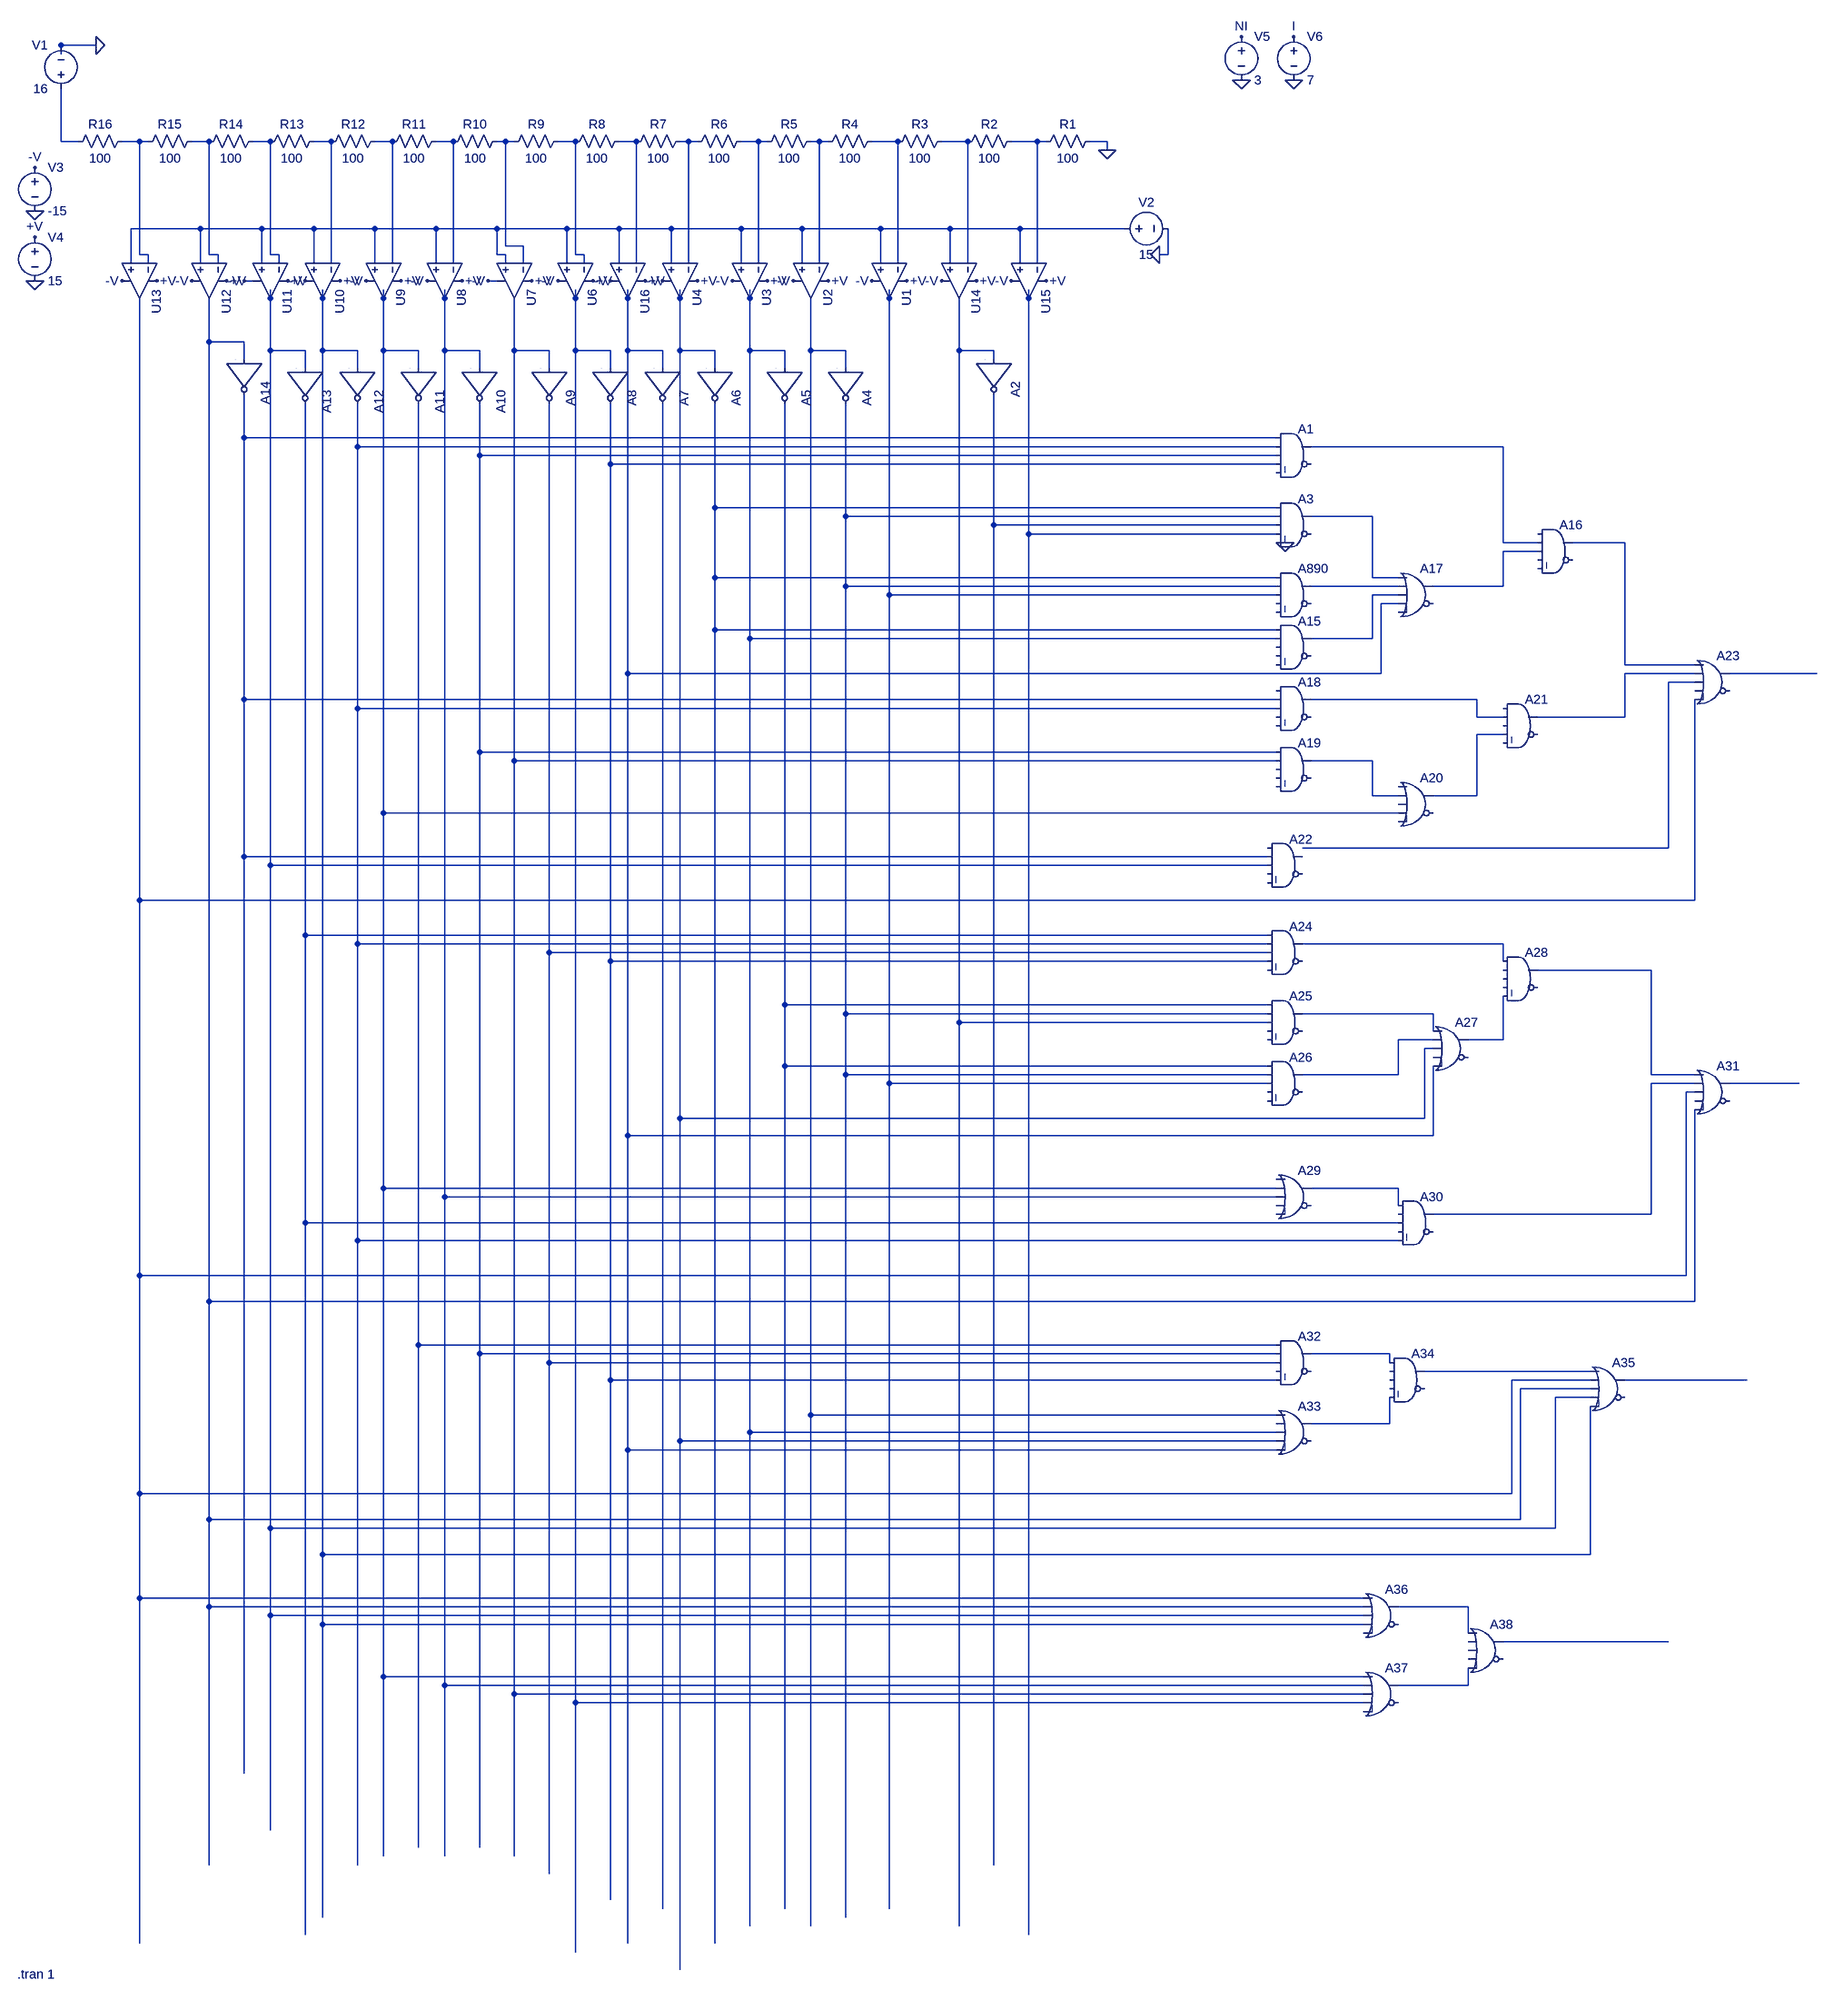
[diagram p0: schematic 4bit_flash_adc.asc]
4bit_flash_adc.asc, the LTspice schematic file:
Version 4
SHEET 1 2788 4056
WIRE -688 -896 -752 -896
WIRE -752 -880 -752 -896
WIRE -752 -720 -752 -816
WIRE -720 -720 -752 -720
WIRE -608 -720 -640 -720
WIRE -592 -720 -608 -720
WIRE -480 -720 -512 -720
WIRE -368 -720 -400 -720
WIRE -256 -720 -288 -720
WIRE -144 -720 -176 -720
WIRE -32 -720 -64 -720
WIRE 64 -720 48 -720
WIRE 80 -720 64 -720
WIRE 192 -720 160 -720
WIRE 304 -720 272 -720
WIRE 400 -720 384 -720
WIRE 416 -720 400 -720
WIRE 528 -720 496 -720
WIRE 544 -720 528 -720
WIRE 640 -720 624 -720
WIRE 656 -720 640 -720
WIRE 784 -720 736 -720
WIRE 912 -720 864 -720
WIRE 1040 -720 992 -720
WIRE 1056 -720 1040 -720
WIRE 1168 -720 1136 -720
WIRE 1168 -704 1168 -720
WIRE -496 -560 -624 -560
WIRE -384 -560 -496 -560
WIRE -288 -560 -384 -560
WIRE -176 -560 -288 -560
WIRE -64 -560 -176 -560
WIRE 48 -560 -64 -560
WIRE 176 -560 48 -560
WIRE 272 -560 176 -560
WIRE 368 -560 272 -560
WIRE 496 -560 368 -560
WIRE 608 -560 496 -560
WIRE 752 -560 608 -560
WIRE 880 -560 752 -560
WIRE 1008 -560 880 -560
WIRE 1200 -560 1008 -560
WIRE 64 -528 64 -720
WIRE 96 -528 64 -528
WIRE -608 -512 -608 -720
WIRE -592 -512 -608 -512
WIRE -480 -512 -480 -720
WIRE -464 -512 -480 -512
WIRE -368 -512 -368 -720
WIRE -352 -512 -368 -512
WIRE 48 -512 48 -560
WIRE 64 -512 48 -512
WIRE 192 -512 192 -720
WIRE 208 -512 192 -512
WIRE 1280 -512 1280 -560
WIRE 1280 -512 1264 -512
WIRE -624 -496 -624 -560
WIRE -592 -496 -592 -512
WIRE -496 -496 -496 -560
WIRE -464 -496 -464 -512
WIRE -384 -496 -384 -560
WIRE -352 -496 -352 -512
WIRE -288 -496 -288 -560
WIRE -256 -496 -256 -720
WIRE -176 -496 -176 -560
WIRE -144 -496 -144 -720
WIRE -64 -496 -64 -560
WIRE -32 -496 -32 -720
WIRE 64 -496 64 -512
WIRE 96 -496 96 -528
WIRE 176 -496 176 -560
WIRE 208 -496 208 -512
WIRE 272 -496 272 -560
WIRE 304 -496 304 -720
WIRE 368 -496 368 -560
WIRE 400 -496 400 -720
WIRE 496 -496 496 -560
WIRE 528 -496 528 -720
WIRE 608 -496 608 -560
WIRE 640 -496 640 -720
WIRE 752 -496 752 -560
WIRE 784 -496 784 -720
WIRE 880 -496 880 -560
WIRE 912 -496 912 -720
WIRE 1008 -496 1008 -560
WIRE 1040 -496 1040 -720
WIRE -400 -464 -416 -464
WIRE 48 -464 32 -464
WIRE -368 -432 -368 -448
WIRE -272 -432 -272 -448
WIRE -160 -432 -160 -448
WIRE -48 -432 -48 -448
WIRE 192 -432 192 -448
WIRE 288 -432 288 -448
WIRE 384 -432 384 -448
WIRE 512 -432 512 -448
WIRE 768 -432 768 -448
WIRE 1024 -432 1024 -448
WIRE -480 -352 -480 -432
WIRE -416 -352 -480 -352
WIRE -368 -336 -368 -432
WIRE -304 -336 -368 -336
WIRE -272 -336 -272 -432
WIRE -208 -336 -272 -336
WIRE -160 -336 -160 -432
WIRE -96 -336 -160 -336
WIRE -48 -336 -48 -432
WIRE 16 -336 -48 -336
WIRE 80 -336 80 -432
WIRE 144 -336 80 -336
WIRE 192 -336 192 -432
WIRE 256 -336 192 -336
WIRE 288 -336 288 -432
WIRE 352 -336 288 -336
WIRE 384 -336 384 -432
WIRE 448 -336 384 -336
WIRE 512 -336 512 -432
WIRE 576 -336 512 -336
WIRE 624 -336 624 -432
WIRE 688 -336 624 -336
WIRE 896 -336 896 -432
WIRE 960 -336 896 -336
WIRE -416 -320 -416 -352
WIRE 960 -320 960 -336
WIRE -304 -304 -304 -336
WIRE -208 -304 -208 -336
WIRE -96 -304 -96 -336
WIRE 16 -304 16 -336
WIRE 144 -304 144 -336
WIRE 256 -304 256 -336
WIRE 352 -304 352 -336
WIRE 448 -304 448 -336
WIRE 576 -304 576 -336
WIRE 688 -304 688 -336
WIRE -416 -176 -416 -256
WIRE 1520 -176 -416 -176
WIRE -208 -160 -208 -240
WIRE 1520 -160 -208 -160
WIRE 1936 -160 1584 -160
WIRE 16 -144 16 -240
WIRE 1520 -144 16 -144
WIRE 256 -128 256 -240
WIRE 1520 -128 256 -128
WIRE 448 -48 448 -240
WIRE 1520 -48 448 -48
WIRE 688 -32 688 -240
WIRE 1520 -32 688 -32
WIRE 1696 -32 1584 -32
WIRE 960 -16 960 -256
WIRE 1520 -16 960 -16
WIRE 1024 0 1024 -432
WIRE 1520 0 1024 0
WIRE 1936 16 1936 -160
WIRE 2000 16 1936 16
WIRE 2160 16 2064 16
WIRE 2000 32 1936 32
WIRE 448 80 448 -48
WIRE 1520 80 448 80
WIRE 1696 80 1696 -32
WIRE 1744 80 1696 80
WIRE 688 96 688 -32
WIRE 1520 96 688 96
WIRE 1744 96 1584 96
WIRE 1936 96 1936 32
WIRE 1936 96 1808 96
WIRE 768 112 768 -432
WIRE 1520 112 768 112
WIRE 1744 112 1696 112
WIRE 1744 128 1712 128
WIRE 448 176 448 80
WIRE 1520 176 448 176
WIRE 512 192 512 -336
WIRE 1520 192 512 192
WIRE 1696 192 1696 112
WIRE 1696 192 1584 192
WIRE 2160 240 2160 16
WIRE 2288 240 2160 240
WIRE 288 256 288 -336
WIRE 1712 256 1712 128
WIRE 1712 256 288 256
WIRE 2288 256 2160 256
WIRE 2512 256 2352 256
WIRE 2288 272 2240 272
WIRE -416 304 -416 -176
WIRE 1520 304 -416 304
WIRE 1888 304 1584 304
WIRE -208 320 -208 -160
WIRE 1520 320 -208 320
WIRE 1888 336 1888 304
WIRE 1936 336 1888 336
WIRE 2160 336 2160 256
WIRE 2160 336 2000 336
WIRE 1936 368 1888 368
WIRE 16 400 16 -144
WIRE 1520 400 16 400
WIRE 80 416 80 -336
WIRE 1520 416 80 416
WIRE 1696 416 1584 416
WIRE 1696 480 1696 416
WIRE 1744 480 1696 480
WIRE 1888 480 1888 368
WIRE 1888 480 1808 480
WIRE -160 512 -160 -336
WIRE 1744 512 -160 512
WIRE 2240 576 2240 272
WIRE 2240 576 1568 576
WIRE -416 592 -416 304
WIRE 1504 592 -416 592
WIRE -368 608 -368 -336
WIRE 1504 608 -368 608
WIRE -608 672 -608 -432
WIRE 2288 672 2288 304
WIRE 2288 672 -608 672
WIRE -304 736 -304 -240
WIRE 1504 736 -304 736
WIRE -208 752 -208 320
WIRE 1504 752 -208 752
WIRE 1936 752 1568 752
WIRE 144 768 144 -240
WIRE 1504 768 144 768
WIRE 256 784 256 -128
WIRE 1504 784 256 784
WIRE 1936 784 1936 752
WIRE 2208 800 2000 800
WIRE 576 864 576 -240
WIRE 1504 864 576 864
WIRE 688 880 688 96
WIRE 1504 880 688 880
WIRE 1808 880 1568 880
WIRE 896 896 896 -336
WIRE 1504 896 896 896
WIRE 1808 912 1808 880
WIRE 1808 928 1744 928
WIRE 1936 928 1936 848
WIRE 1936 928 1872 928
WIRE 1808 944 1792 944
WIRE 576 976 576 864
WIRE 1504 976 576 976
WIRE 688 992 688 880
WIRE 1504 992 688 992
WIRE 1744 992 1744 928
WIRE 1744 992 1568 992
WIRE 2208 992 2208 800
WIRE 2288 992 2208 992
WIRE 768 1008 768 112
WIRE 1504 1008 768 1008
WIRE 2288 1008 2208 1008
WIRE 2480 1008 2352 1008
WIRE 2288 1024 2272 1024
WIRE 384 1072 384 -336
WIRE 1792 1072 1792 944
WIRE 1792 1072 384 1072
WIRE 288 1104 288 256
WIRE 1808 1104 1808 976
WIRE 1808 1104 288 1104
WIRE -160 1200 -160 512
WIRE 1520 1200 -160 1200
WIRE 1744 1200 1584 1200
WIRE -48 1216 -48 -336
WIRE 1520 1216 -48 1216
WIRE 1744 1232 1744 1200
WIRE 2208 1248 2208 1008
WIRE 2208 1248 1808 1248
WIRE -304 1264 -304 736
WIRE 1744 1264 -304 1264
WIRE -208 1296 -208 752
WIRE 1744 1296 -208 1296
WIRE -608 1360 -608 672
WIRE 2272 1360 2272 1024
WIRE 2272 1360 -608 1360
WIRE -480 1408 -480 -352
WIRE 2288 1408 2288 1056
WIRE 2288 1408 -480 1408
WIRE -96 1488 -96 -240
WIRE 1520 1488 -96 1488
WIRE 16 1504 16 400
WIRE 1520 1504 16 1504
WIRE 1728 1504 1584 1504
WIRE 144 1520 144 768
WIRE 1520 1520 144 1520
WIRE 1728 1520 1728 1504
WIRE 2096 1536 1792 1536
WIRE 256 1552 256 784
WIRE 1520 1552 256 1552
WIRE 2096 1552 1952 1552
WIRE 2384 1552 2160 1552
WIRE 2096 1568 1968 1568
WIRE 2096 1584 2032 1584
WIRE 624 1616 624 -336
WIRE 1520 1616 624 1616
WIRE 1728 1632 1728 1584
WIRE 1728 1632 1584 1632
WIRE 512 1648 512 192
WIRE 1520 1648 512 1648
WIRE 384 1664 384 1072
WIRE 1520 1664 384 1664
WIRE 288 1680 288 1104
WIRE 1520 1680 288 1680
WIRE -608 1760 -608 1360
WIRE 1952 1760 1952 1552
WIRE 1952 1760 -608 1760
WIRE -480 1808 -480 1408
WIRE 1968 1808 1968 1568
WIRE 1968 1808 -480 1808
WIRE -368 1824 -368 608
WIRE 2032 1824 2032 1584
WIRE 2032 1824 -368 1824
WIRE -272 1872 -272 -336
WIRE 2096 1872 2096 1600
WIRE 2096 1872 -272 1872
WIRE -608 1952 -608 1760
WIRE 1680 1952 -608 1952
WIRE -480 1968 -480 1808
WIRE 1680 1968 -480 1968
WIRE 1872 1968 1744 1968
WIRE -368 1984 -368 1824
WIRE 1680 1984 -368 1984
WIRE -272 2000 -272 1872
WIRE 1680 2000 -272 2000
WIRE 1872 2016 1872 1968
WIRE 2240 2032 1936 2032
WIRE -160 2096 -160 1200
WIRE 1680 2096 -160 2096
WIRE -48 2112 -48 1216
WIRE 1680 2112 -48 2112
WIRE 1872 2112 1872 2080
WIRE 1872 2112 1744 2112
WIRE 80 2128 80 416
WIRE 1680 2128 80 2128
WIRE 192 2144 192 -336
WIRE 1680 2144 192 2144
WIRE -416 3584 -416 592
WIRE -368 3776 -368 1984
WIRE -96 3808 -96 1488
WIRE 16 3808 16 1504
WIRE -160 3824 -160 2096
WIRE -48 3824 -48 2112
WIRE 80 3824 80 2128
WIRE -480 3840 -480 1968
WIRE -208 3840 -208 1296
WIRE 960 3840 960 -16
WIRE 144 3856 144 1520
WIRE 256 3904 256 1552
WIRE 352 3920 352 -240
WIRE 576 3920 576 976
WIRE 768 3920 768 1008
WIRE -272 3936 -272 2000
WIRE 688 3936 688 992
WIRE 512 3952 512 1648
WIRE 624 3952 624 1616
WIRE 896 3952 896 896
WIRE -304 3968 -304 1264
WIRE 1024 3968 1024 0
WIRE -608 3984 -608 1952
WIRE 288 3984 288 1680
WIRE 448 3984 448 176
WIRE 192 4000 192 2144
WIRE 384 4032 384 1664
FLAG 1264 -512 0
FLAG -800 -592 0
FLAG -800 -464 0
FLAG -800 -672 -V
FLAG -640 -464 -V
FLAG -512 -464 -V
FLAG -304 -464 -V
FLAG -416 -464 -V
FLAG -192 -464 -V
FLAG -80 -464 -V
FLAG 32 -464 -V
FLAG 160 -464 -V
FLAG 480 -464 -V
FLAG 592 -464 -V
FLAG 736 -464 -V
FLAG 864 -464 -V
FLAG 992 -464 -V
FLAG -800 -544 +V
FLAG -576 -464 +V
FLAG -448 -464 +V
FLAG -336 -464 +V
FLAG -240 -464 +V
FLAG -128 -464 +V
FLAG -16 -464 +V
FLAG 112 -464 +V
FLAG 416 -464 +V
FLAG 544 -464 +V
FLAG 656 -464 +V
FLAG 800 -464 +V
FLAG 928 -464 +V
FLAG 1056 -464 +V
FLAG -688 -896 0
FLAG 1168 -704 0
FLAG 352 -464 -V
FLAG 320 -464 +V
FLAG 256 -464 -V
FLAG 224 -464 +V
FLAG 1456 -832 0
FLAG 1552 -832 0
FLAG 1456 -912 NI
FLAG 1552 -912 I
FLAG 1536 16 0
SYMBOL res 1152 -736 R90
WINDOW 0 0 56 VBottom 2
WINDOW 3 32 56 VTop 2
SYMATTR InstName R1
SYMATTR Value 100
SYMBOL res 1008 -736 R90
WINDOW 0 0 56 VBottom 2
WINDOW 3 32 56 VTop 2
SYMATTR InstName R2
SYMATTR Value 100
SYMBOL res 880 -736 R90
WINDOW 0 0 56 VBottom 2
WINDOW 3 32 56 VTop 2
SYMATTR InstName R3
SYMATTR Value 100
SYMBOL res 752 -736 R90
WINDOW 0 0 56 VBottom 2
WINDOW 3 32 56 VTop 2
SYMATTR InstName R4
SYMATTR Value 100
SYMBOL res 640 -736 R90
WINDOW 0 0 56 VBottom 2
WINDOW 3 32 56 VTop 2
SYMATTR InstName R5
SYMATTR Value 100
SYMBOL res 512 -736 R90
WINDOW 0 0 56 VBottom 2
WINDOW 3 32 56 VTop 2
SYMATTR InstName R6
SYMATTR Value 100
SYMBOL res 400 -736 R90
WINDOW 0 0 56 VBottom 2
WINDOW 3 32 56 VTop 2
SYMATTR InstName R7
SYMATTR Value 100
SYMBOL res 288 -736 R90
WINDOW 0 0 56 VBottom 2
WINDOW 3 32 56 VTop 2
SYMATTR InstName R8
SYMATTR Value 100
SYMBOL res 176 -736 R90
WINDOW 0 0 56 VBottom 2
WINDOW 3 32 56 VTop 2
SYMATTR InstName R9
SYMATTR Value 100
SYMBOL res 64 -736 R90
WINDOW 0 0 56 VBottom 2
WINDOW 3 32 56 VTop 2
SYMATTR InstName R10
SYMATTR Value 100
SYMBOL res -48 -736 R90
WINDOW 0 0 56 VBottom 2
WINDOW 3 32 56 VTop 2
SYMATTR InstName R11
SYMATTR Value 100
SYMBOL res -160 -736 R90
WINDOW 0 0 56 VBottom 2
WINDOW 3 32 56 VTop 2
SYMATTR InstName R12
SYMATTR Value 100
SYMBOL res -272 -736 R90
WINDOW 0 0 56 VBottom 2
WINDOW 3 32 56 VTop 2
SYMATTR InstName R13
SYMATTR Value 100
SYMBOL res -384 -736 R90
WINDOW 0 0 56 VBottom 2
WINDOW 3 32 56 VTop 2
SYMATTR InstName R14
SYMATTR Value 100
SYMBOL res -496 -736 R90
WINDOW 0 0 56 VBottom 2
WINDOW 3 32 56 VTop 2
SYMATTR InstName R15
SYMATTR Value 100
SYMBOL res -624 -736 R90
WINDOW 0 0 56 VBottom 2
WINDOW 3 32 56 VTop 2
SYMATTR InstName R16
SYMATTR Value 100
SYMBOL voltage 1184 -560 R270
WINDOW 0 32 56 VTop 2
WINDOW 3 -32 56 VBottom 2
WINDOW 123 0 0 Left 0
WINDOW 39 0 0 Left 0
SYMATTR InstName V2
SYMATTR Value 15
SYMBOL Digital\\inv -352 -320 R90
SYMATTR InstName A14
SYMBOL Digital\\inv -240 -304 R90
SYMATTR InstName A13
SYMBOL Digital\\inv -144 -304 R90
SYMATTR InstName A12
SYMBOL Digital\\inv -32 -304 R90
SYMATTR InstName A11
SYMBOL Digital\\inv 80 -304 R90
SYMATTR InstName A10
SYMBOL Digital\\inv 1024 -320 R90
SYMATTR InstName A2
SYMBOL Digital\\inv 752 -304 R90
SYMATTR InstName A4
SYMBOL Digital\\inv 640 -304 R90
SYMATTR InstName A5
SYMBOL Digital\\inv 512 -304 R90
SYMATTR InstName A6
SYMBOL Digital\\inv 416 -304 R90
SYMATTR InstName A7
SYMBOL Digital\\inv 208 -304 R90
SYMATTR InstName A9
SYMBOL Digital\\and 1552 -208 R0
SYMATTR InstName A1
SYMBOL Digital\\and 1552 -80 R0
SYMATTR InstName A3
SYMBOL Digital\\and 1552 48 R0
SYMATTR InstName A890
SYMBOL Digital\\and 1552 144 R0
SYMATTR InstName A15
SYMBOL Digital\\or 1776 48 R0
SYMATTR InstName A17
SYMBOL Digital\\and 2032 -32 R0
SYMATTR InstName A16
SYMBOL Digital\\and 1552 256 R0
SYMATTR InstName A18
SYMBOL Digital\\and 1552 368 R0
SYMATTR InstName A19
SYMBOL Digital\\or 1776 432 R0
SYMATTR InstName A20
SYMBOL Digital\\and 1968 288 R0
SYMATTR InstName A21
SYMBOL Digital\\and 1536 544 R0
SYMATTR InstName A22
SYMBOL Digital\\or 2320 208 R0
SYMATTR InstName A23
SYMBOL Digital\\and 1536 704 R0
SYMATTR InstName A24
SYMBOL Digital\\inv 320 -304 R90
SYMATTR InstName A8
SYMBOL Digital\\and 1536 832 R0
SYMATTR InstName A25
SYMBOL Digital\\and 1536 944 R0
SYMATTR InstName A26
SYMBOL Digital\\or 1840 880 R0
SYMATTR InstName A27
SYMBOL Digital\\and 1968 752 R0
SYMATTR InstName A28
SYMBOL Digital\\or 1552 1152 R0
SYMATTR InstName A29
SYMBOL Digital\\and 1776 1200 R0
SYMATTR InstName A30
SYMBOL Digital\\or 2320 960 R0
SYMATTR InstName A31
SYMBOL Digital\\and 1552 1456 R0
SYMATTR InstName A32
SYMBOL Digital\\or 1552 1584 R0
SYMATTR InstName A33
SYMBOL Digital\\and 1760 1488 R0
SYMATTR InstName A34
SYMBOL Digital\\or 2128 1504 R0
SYMATTR InstName A35
SYMBOL Digital\\or 1712 1920 R0
SYMATTR InstName A36
SYMBOL Digital\\or 1712 2064 R0
SYMATTR InstName A37
SYMBOL Digital\\or 1904 1984 R0
SYMATTR InstName A38
SYMBOL voltage -800 -688 R0
WINDOW 123 0 0 Left 0
WINDOW 39 0 0 Left 0
SYMATTR InstName V3
SYMATTR Value -15
SYMBOL voltage -800 -560 R0
WINDOW 123 0 0 Left 0
WINDOW 39 0 0 Left 0
SYMATTR InstName V4
SYMATTR Value 15
SYMBOL voltage -752 -800 R180
WINDOW 0 24 96 Left 2
WINDOW 3 24 16 Left 2
WINDOW 123 0 0 Left 0
WINDOW 39 0 0 Left 0
SYMATTR InstName V1
SYMATTR Value 16
SYMBOL OpAmps\\UniversalOpAmp2 1024 -464 R90
SYMATTR InstName U15
SYMBOL OpAmps\\UniversalOpAmp2 768 -464 R90
SYMATTR InstName U1
SYMBOL OpAmps\\UniversalOpAmp2 624 -464 R90
SYMATTR InstName U2
SYMBOL OpAmps\\UniversalOpAmp2 512 -464 R90
SYMATTR InstName U3
SYMBOL OpAmps\\UniversalOpAmp2 384 -464 R90
SYMATTR InstName U4
SYMBOL OpAmps\\UniversalOpAmp2 192 -464 R90
SYMATTR InstName U6
SYMBOL OpAmps\\UniversalOpAmp2 80 -464 R90
SYMATTR InstName U7
SYMBOL OpAmps\\UniversalOpAmp2 -48 -464 R90
SYMATTR InstName U8
SYMBOL OpAmps\\UniversalOpAmp2 -160 -464 R90
SYMATTR InstName U9
SYMBOL OpAmps\\UniversalOpAmp2 -272 -464 R90
SYMATTR InstName U10
SYMBOL OpAmps\\UniversalOpAmp2 -368 -464 R90
SYMATTR InstName U11
SYMBOL OpAmps\\UniversalOpAmp2 -480 -464 R90
SYMATTR InstName U12
SYMBOL OpAmps\\UniversalOpAmp2 -608 -464 R90
SYMATTR InstName U13
SYMBOL OpAmps\\UniversalOpAmp2 896 -464 R90
SYMATTR InstName U14
SYMBOL OpAmps\\UniversalOpAmp2 288 -464 R90
SYMATTR InstName U16
SYMBOL voltage 1456 -928 R0
WINDOW 123 0 0 Left 0
WINDOW 39 0 0 Left 0
SYMATTR InstName V5
SYMATTR Value 3
SYMBOL voltage 1552 -928 R0
WINDOW 123 0 0 Left 0
WINDOW 39 0 0 Left 0
SYMATTR InstName V6
SYMATTR Value 7
TEXT -832 4040 Left 2 !.tran 1

The netlist it stands for:
* 4bit_flash_adc.asc
R1 0 N016 100
R2 N016 N015 100
R3 N015 N014 100
R4 N014 N013 100
R5 N013 N012 100
R6 N012 N011 100
R7 N011 N010 100
R8 N010 N009 100
R9 N009 N008 100
R10 N008 N007 100
R11 N007 N006 100
R12 N006 N005 100
R13 N005 N004 100
R14 N004 N003 100
R15 N003 N002 100
R16 N002 N001 100
V2 N017 0 15
A14 N028 0 0 0 0 N032 0 0 BUF
A13 N018 0 0 0 0 N052 0 0 BUF
A12 N019 0 0 0 0 N033 0 0 BUF
A11 N020 0 0 0 0 N063 0 0 BUF
A10 N021 0 0 0 0 N035 0 0 BUF
A2 N031 0 0 0 0 N040 0 0 BUF
A4 N030 0 0 0 0 N038 0 0 BUF
A5 N025 0 0 0 0 N056 0 0 BUF
A6 N024 0 0 0 0 N037 0 0 BUF
A7 N023 0 0 0 0 N071 0 0 BUF
A9 N029 0 0 0 0 N054 0 0 BUF
A1 N032 N033 N035 N036 0 0 N034 0 AND
A3 N037 N038 N040 N027 0 0 N039 0 AND
A890 N037 N038 N026 0 0 0 N043 0 AND
A15 N037 N025 0 0 0 0 N044 0 AND
A17 N039 N043 N044 N023 0 0 N042 0 OR
A16 0 N034 N042 0 0 0 N041 0 AND
A18 0 N032 N033 0 0 0 N048 0 AND
A19 N035 N029 0 0 0 0 N050 0 AND
A20 0 N050 0 N020 0 0 N049 0 OR
A21 0 N048 0 N049 0 0 N045 0 AND
A22 0 N032 N018 0 0 0 0 0 AND
A23 N041 N045 N047 0 N051 0 N046 0 OR
A24 N052 N033 N054 N036 0 0 N053 0 AND
A8 N022 0 0 0 0 N036 0 0 BUF
A25 N056 N038 N031 0 0 0 N057 0 AND
A26 N056 N038 N026 0 0 0 N058 0 AND
A27 N057 N058 N024 0 N023 0 N059 0 OR
A28 N053 0 0 0 N059 0 N055 0 AND
A29 0 N020 N021 0 0 0 N062 0 OR
A30 N062 0 N052 0 N033 0 N060 0 AND
A31 N055 N060 N051 0 N028 0 N061 0 OR
A32 N063 N035 N054 0 N036 0 N064 0 AND
A33 N030 0 N025 N024 N023 0 N067 0 OR
A34 N064 0 0 0 N067 0 N065 0 AND
A35 N065 N051 N028 N018 N019 0 N066 0 OR
A36 N051 N028 N018 N019 0 0 N068 0 OR
A37 N020 N021 N029 N022 0 0 N070 0 OR
A38 N068 0 0 0 N070 0 N069 0 OR
V3 -V 0 -15
V4 +V 0 15
V1 N001 0 16
XU15 N017 N016 +V -V N027 level2 Avol=1Meg GBW=10Meg Slew=10Meg Ilimit=25m Rail=0 Vos=0 En=0 Enk=0 In=0 Ink=0 Rin=500Meg  ; pins In+ In- V+ V- OUT
XU1 N017 N014 +V -V N026 level2 Avol=1Meg GBW=10Meg Slew=10Meg Ilimit=25m Rail=0 Vos=0 En=0 Enk=0 In=0 Ink=0 Rin=500Meg  ; pins In+ In- V+ V- OUT
XU2 N017 N013 +V -V N030 level2 Avol=1Meg GBW=10Meg Slew=10Meg Ilimit=25m Rail=0 Vos=0 En=0 Enk=0 In=0 Ink=0 Rin=500Meg  ; pins In+ In- V+ V- OUT
XU3 N017 N012 +V -V N025 level2 Avol=1Meg GBW=10Meg Slew=10Meg Ilimit=25m Rail=0 Vos=0 En=0 Enk=0 In=0 Ink=0 Rin=500Meg  ; pins In+ In- V+ V- OUT
XU4 N017 N011 +V -V N024 level2 Avol=1Meg GBW=10Meg Slew=10Meg Ilimit=25m Rail=0 Vos=0 En=0 Enk=0 In=0 Ink=0 Rin=500Meg  ; pins In+ In- V+ V- OUT
XU6 N017 N009 +V -V N022 level2 Avol=1Meg GBW=10Meg Slew=10Meg Ilimit=25m Rail=0 Vos=0 En=0 Enk=0 In=0 Ink=0 Rin=500Meg  ; pins In+ In- V+ V- OUT
XU7 N017 N008 +V -V N029 level2 Avol=1Meg GBW=10Meg Slew=10Meg Ilimit=25m Rail=0 Vos=0 En=0 Enk=0 In=0 Ink=0 Rin=500Meg  ; pins In+ In- V+ V- OUT
XU8 N017 N007 +V -V N021 level2 Avol=1Meg GBW=10Meg Slew=10Meg Ilimit=25m Rail=0 Vos=0 En=0 Enk=0 In=0 Ink=0 Rin=500Meg  ; pins In+ In- V+ V- OUT
XU9 N017 N006 +V -V N020 level2 Avol=1Meg GBW=10Meg Slew=10Meg Ilimit=25m Rail=0 Vos=0 En=0 Enk=0 In=0 Ink=0 Rin=500Meg  ; pins In+ In- V+ V- OUT
XU10 N017 N005 +V -V N019 level2 Avol=1Meg GBW=10Meg Slew=10Meg Ilimit=25m Rail=0 Vos=0 En=0 Enk=0 In=0 Ink=0 Rin=500Meg  ; pins In+ In- V+ V- OUT
XU11 N017 N004 +V -V N018 level2 Avol=1Meg GBW=10Meg Slew=10Meg Ilimit=25m Rail=0 Vos=0 En=0 Enk=0 In=0 Ink=0 Rin=500Meg  ; pins In+ In- V+ V- OUT
XU12 N017 N003 +V -V N028 level2 Avol=1Meg GBW=10Meg Slew=10Meg Ilimit=25m Rail=0 Vos=0 En=0 Enk=0 In=0 Ink=0 Rin=500Meg  ; pins In+ In- V+ V- OUT
XU13 N017 N002 +V -V N051 level2 Avol=1Meg GBW=10Meg Slew=10Meg Ilimit=25m Rail=0 Vos=0 En=0 Enk=0 In=0 Ink=0 Rin=500Meg  ; pins In+ In- V+ V- OUT
XU14 N017 N015 +V -V N031 level2 Avol=1Meg GBW=10Meg Slew=10Meg Ilimit=25m Rail=0 Vos=0 En=0 Enk=0 In=0 Ink=0 Rin=500Meg  ; pins In+ In- V+ V- OUT
XU16 N017 N010 +V -V N023 level2 Avol=1Meg GBW=10Meg Slew=10Meg Ilimit=25m Rail=0 Vos=0 En=0 Enk=0 In=0 Ink=0 Rin=500Meg  ; pins In+ In- V+ V- OUT
V5 NI 0 3
V6 I 0 7
.tran 1
.lib UniversalOpAmp2.lib
.backanno
.end